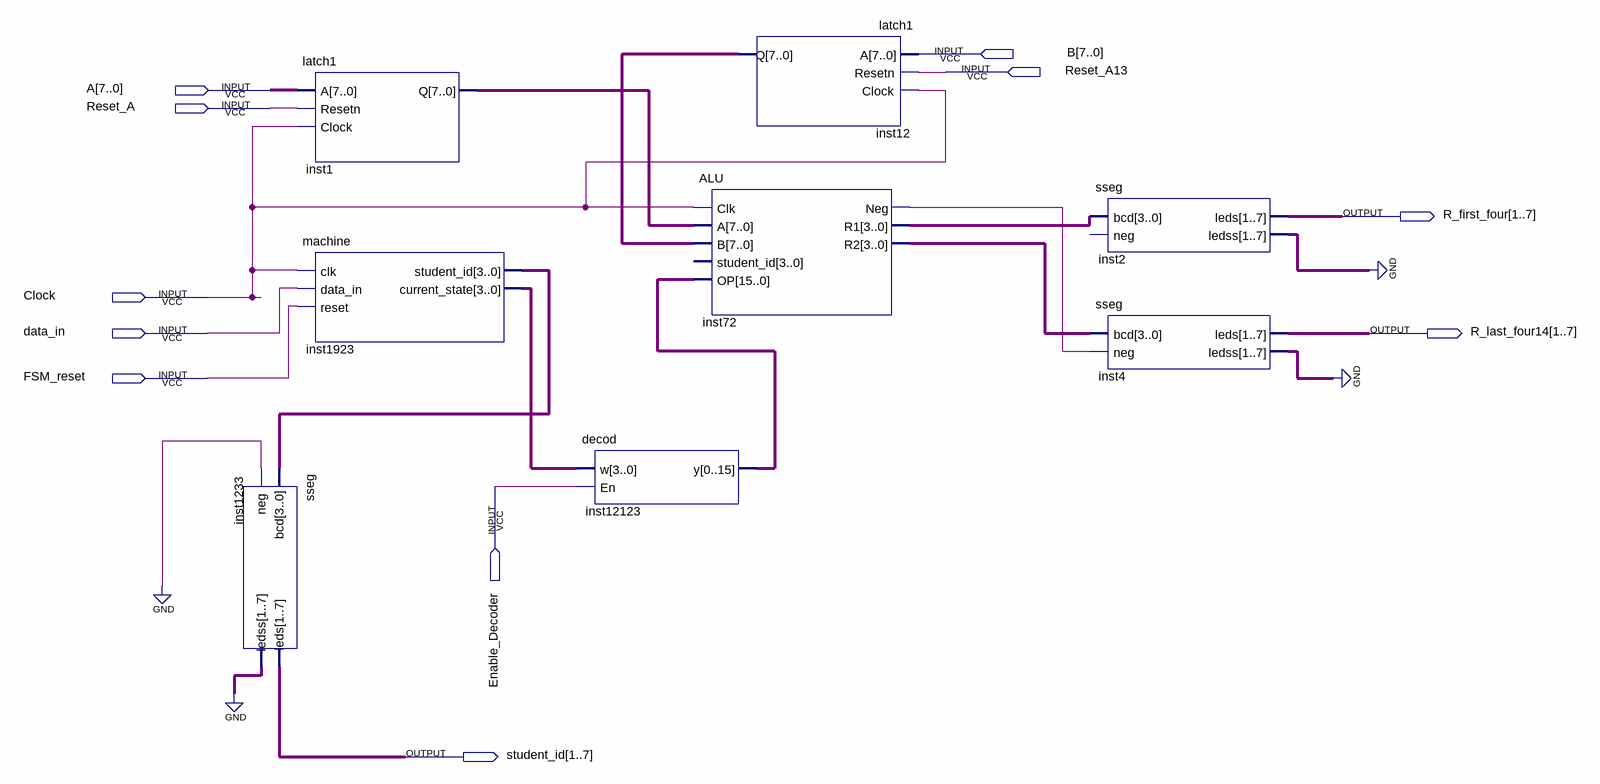
[diagram p0: schematic sheet]
// Quartus schematic Block5.bdf as structural Verilog: 8 symbols, 11 pins
module Block5 (
  input  [7:0] B,
  input  Reset_A13,
  input  [7:0] A,
  input  Reset_A,
  input  Clock,
  input  data_in,
  input  FSM_reset,
  input  Enable_Decoder,
  output [1:7] R_first_four,
  output [1:7] R_last_four14,
  output [1:7] student_id
);

  wire inst72_neg;
  wire [3:0] inst72_r1, inst72_r2, inst1923_current_state, inst1923_student_id;
  wire [6:0] inst2_ledss, inst4_ledss, inst1233_ledss;
  wire [7:0] inst1_q, inst12_q;
  wire [15:0] inst12123_y;

  sseg inst1233 (.bcd(inst1923_student_id), .neg(1'b0), .leds(student_id), .ledss(inst1233_ledss));
  latch1 inst1 (.A(A), .Resetn(Reset_A), .Clock(Clock), .Q(inst1_q));
  machine inst1923 (
    .clk(Clock), .data_in(data_in), .reset(FSM_reset), .student_id(inst1923_student_id),
    .current_state(inst1923_current_state));
  decod inst12123 (.w(inst1923_current_state), .En(Enable_Decoder), .y(inst12123_y));
  latch1 inst12 (.A(B), .Resetn(Reset_A13), .Clock(Clock), .Q(inst12_q));
  ALU inst72 (
    .Clk(Clock), .A(inst1_q), .B(inst12_q), .OP(inst12123_y), .Neg(inst72_neg), .R1(inst72_r1), .R2(inst72_r2));  // open: student_id
  sseg inst2 (.bcd(inst72_r1), .leds(R_first_four), .ledss(inst2_ledss));  // open: neg
  sseg inst4 (.bcd(inst72_r2), .neg(inst72_neg), .leds(R_last_four14), .ledss(inst4_ledss));
  // also tied to GND on the sheet: {inst1233_ledss[0], inst1233_ledss[1], inst1233_ledss[2], inst1233_ledss[3], inst1233_ledss[4], inst1233_ledss[5], inst1233_ledss[6], inst2_ledss[0], inst2_ledss[1], inst2_ledss[2], inst2_ledss[3], inst2_ledss[4], inst2_ledss[5], inst2_ledss[6], inst4_ledss[0], inst4_ledss[1], inst4_ledss[2], inst4_ledss[3], inst4_ledss[4], inst4_ledss[5], inst4_ledss[6]}
endmodule
